# Altium schematic sheet Block_diagram.SchDoc
size A; SheetNumber: 1; SheetTotal: 6
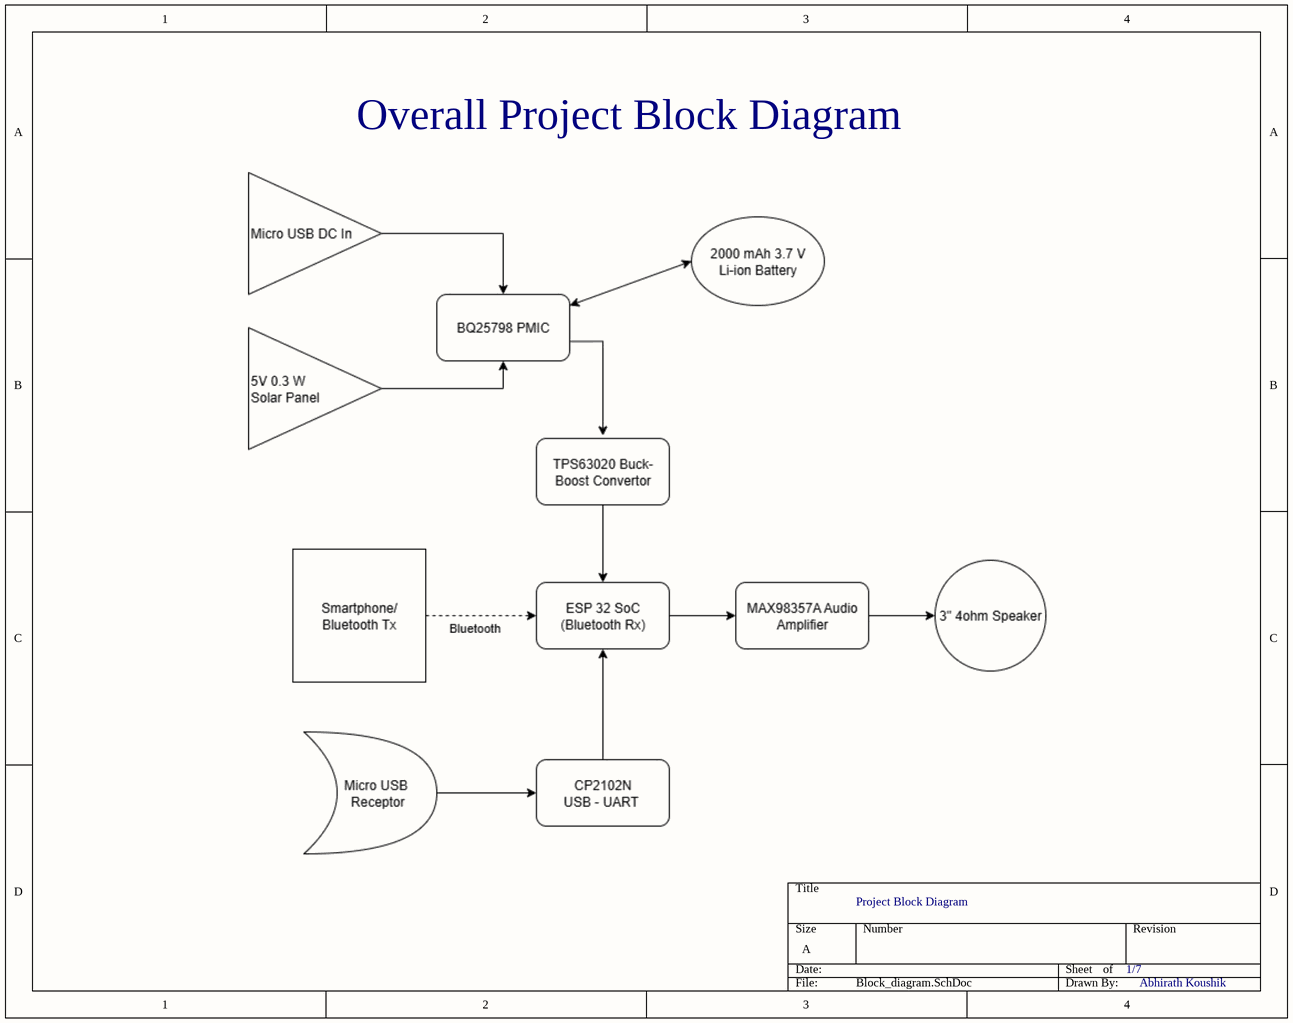
[diagram p0: Block_diagram.SchDoc]

## Notes on the sheet
- Overall Project Block Diagram
- Project Block Diagram
- 1/7
- Abhirath Koushik